# Altium schematic sheet BUZZER.SchDoc
size A; SheetNumber: 9; SheetTotal: 9
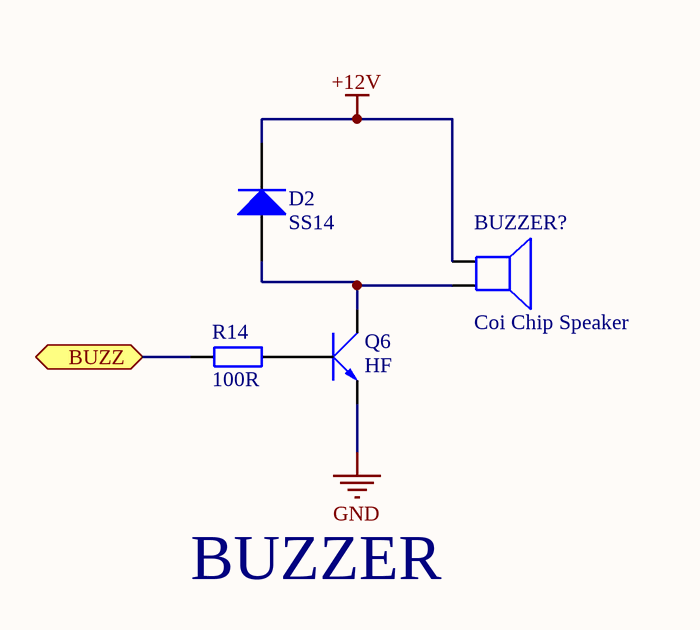
[diagram p0: BUZZER.SchDoc]

## Parts
BUZZER?  Coi Chip Speaker  [Coi Chip Speacker]
D2  SS14  [DIODE SMA]
Q6  HF  [SOT23]
R14  100R  [tro smd 0603]

## Ports
BUZZ (bidir)

## Nets
+12V: BUZZER?.1 D2.2(K)
GND: Q6.2(E)
BUZZ: R14.1 ; port BUZZ
NetBUZZER?_2: BUZZER?.2 D2.1(A) Q6.3(C)
NetQ6_1: Q6.1(B) R14.2

## Notes on the sheet
- BUZZER

## Library data of the parts
BUZZER? = Coi Chip Speaker: Còi chip
D2 = Diode SS14 ( 1N5819): Dán; Ma_Hang: MH002211; Don_Vi: Con; Ten_Linh_Kien: Diode SS14 DO214 Schottky 1A 40V ( 1N5819 DO214); Chung_Loai: Dán; Ghi_Chu: *; Kieu_Chan: *
Q6 = C1815 HF SMD: NPN transistor; Value: C9014
R14 = Tro 0603 5% 100R: Dán; Don_Vi: Con; So_Chan: 2; Ten_Linh_Kien: Trở 0603 5% 100R; Ma_Hang: MH006315; Chung_Loai: Dán; Kieu_Chan: *